# Altium schematic sheet Connectors.SchDoc: Arm - Connectors
size Letter; DrawnBy: K.Hong, N.Chapman; Organization: UW Robotics; Address1: 200 University Avenue; Address2: Waterloo; Address3: Ontario; Address4: Canada N2L 3G6; SheetNumber: 3; SheetTotal: 9
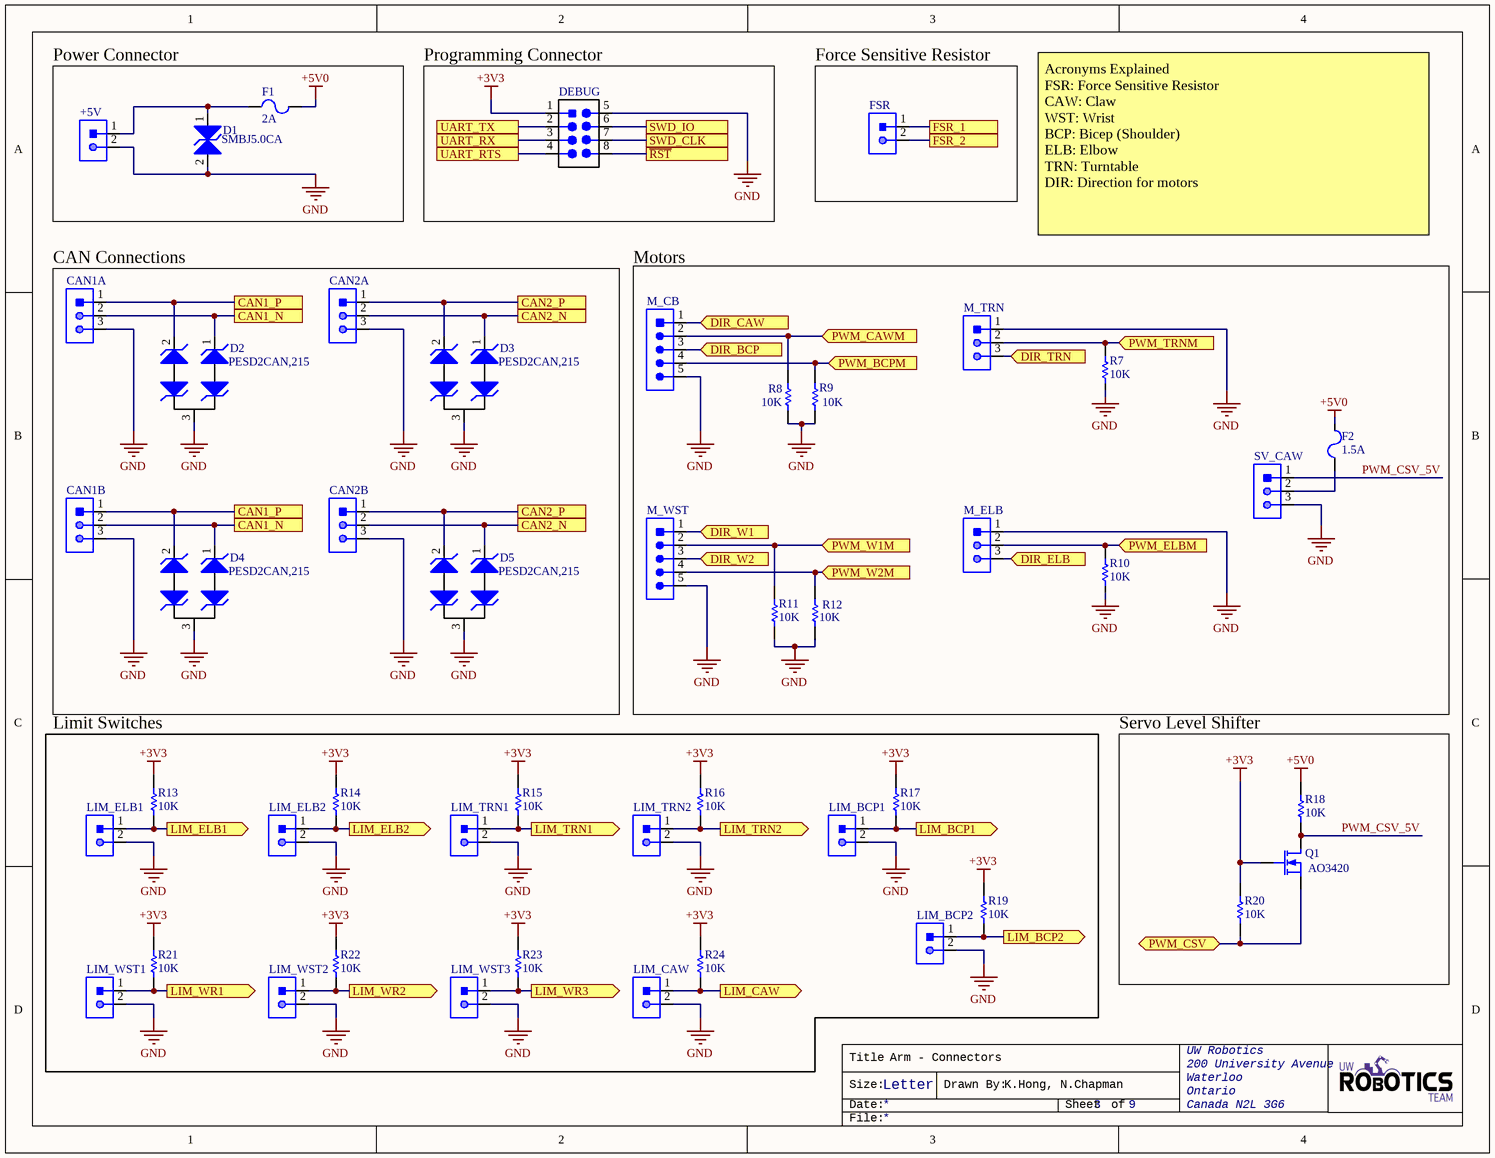
[diagram p0: Connectors.SchDoc]

## Parts
+5V  CON_2M_SM4  [JST-B2B-SM4-TB]  (value not drawn)
CAN1A  CON_3M_SM4  [JST-B3B-SM4-TB]  (value not drawn)
CAN1B  CON_3M_SM4  [JST-B3B-SM4-TB]  (value not drawn)
CAN2A  CON_3M_SM4  [JST-B3B-SM4-TB]  (value not drawn)
CAN2B  CON_3M_SM4  [JST-B3B-SM4-TB]  (value not drawn)
D1  Manufacturer Part Number 1: SMBJ5.0CA  [TVS_DIODE_BIDIRECTIONAL]  (hidden comment: TVS_DIODE_BIDIRECTIONAL)
D2  Manufacturer Part Number: PESD2CAN,215  [NXP-SOT323-3]  (hidden comment: TVS_DIODE_CAN)
D3  Manufacturer Part Number: PESD2CAN,215  [NXP-SOT323-3]  (hidden comment: TVS_DIODE_CAN)
D4  Manufacturer Part Number: PESD2CAN,215  [NXP-SOT323-3]  (hidden comment: TVS_DIODE_CAN)
D5  Manufacturer Part Number: PESD2CAN,215  [NXP-SOT323-3]  (hidden comment: TVS_DIODE_CAN)
DEBUG  HEADER 4X2  [HEADER_2X4]  (value not drawn)
F1  Current Rating: 2A  [FUSE_0603]  (hidden comment: FUSE_2A_0603)
F2  Current Rating: 1.5A  [FUSE_0603]  (hidden comment: FUSE_1.5A_0603)
FSR  CON_2M_SM4  [JST-B2B-SM4-TB]  (value not drawn)
LIM_BCP1  CON_2M_SM4  [JST-B2B-SM4-TB]  (value not drawn)
LIM_BCP2  CON_2M_SM4  [JST-B2B-SM4-TB]  (value not drawn)
LIM_CAW  CON_2M_SM4  [JST-B2B-SM4-TB]  (value not drawn)
LIM_ELB1  CON_2M_SM4  [JST-B2B-SM4-TB]  (value not drawn)
LIM_ELB2  CON_2M_SM4  [JST-B2B-SM4-TB]  (value not drawn)
LIM_TRN1  CON_2M_SM4  [JST-B2B-SM4-TB]  (value not drawn)
LIM_TRN2  CON_2M_SM4  [JST-B2B-SM4-TB]  (value not drawn)
LIM_WST1  CON_2M_SM4  [JST-B2B-SM4-TB]  (value not drawn)
LIM_WST2  CON_2M_SM4  [JST-B2B-SM4-TB]  (value not drawn)
LIM_WST3  CON_2M_SM4  [JST-B2B-SM4-TB]  (value not drawn)
M_CB  CON_5M_SM4  [JST-B5B-SM4-TB]  (value not drawn)
M_ELB  CON_3M_SM4  [JST-B3B-SM4-TB]  (value not drawn)
M_TRN  CON_3M_SM4  [JST-B3B-SM4-TB]  (value not drawn)
M_WST  CON_5M_SM4  [JST-B5B-SM4-TB]  (value not drawn)
Q1  MPN: AO3420  [NMOS_SOT23-3]  (hidden comment: NMOS_20V_6A)
R7  value 10K  [RESC0603(1608)_N]  (hidden comment: RES_10K_0603)
R8  value 10K  [RESC0603(1608)_N]  (hidden comment: RES_10K_0603)
R9  value 10K  [RESC0603(1608)_N]  (hidden comment: RES_10K_0603)
R10  value 10K  [RESC0603(1608)_N]  (hidden comment: RES_10K_0603)
R11  value 10K  [RESC0603(1608)_N]  (hidden comment: RES_10K_0603)
R12  value 10K  [RESC0603(1608)_N]  (hidden comment: RES_10K_0603)
R13  value 10K  [RESC0603(1608)_N]  (hidden comment: RES_10K_0603)
R14  value 10K  [RESC0603(1608)_N]  (hidden comment: RES_10K_0603)
R15  value 10K  [RESC0603(1608)_N]  (hidden comment: RES_10K_0603)
R16  value 10K  [RESC0603(1608)_N]  (hidden comment: RES_10K_0603)
R17  value 10K  [RESC0603(1608)_N]  (hidden comment: RES_10K_0603)
R18  value 10K  [RESC0603(1608)_N]  (hidden comment: RES_10K_0603)
R19  value 10K  [RESC0603(1608)_N]  (hidden comment: RES_10K_0603)
R20  value 10K  [RESC0603(1608)_N]  (hidden comment: RES_10K_0603)
R21  value 10K  [RESC0603(1608)_N]  (hidden comment: RES_10K_0603)
R22  value 10K  [RESC0603(1608)_N]  (hidden comment: RES_10K_0603)
R23  value 10K  [RESC0603(1608)_N]  (hidden comment: RES_10K_0603)
R24  value 10K  [RESC0603(1608)_N]  (hidden comment: RES_10K_0603)
SV_CAW  CON_3M_SM4  [JST-B3B-SM4-TB]  (value not drawn)

## Blocks framed on the sheet
Power Connector: +5V D1 F1
Programming Connector: DEBUG
Force Sensitive Resistor: FSR
CAN Connections: CAN1A CAN1B CAN2A CAN2B D2-D5
Motors: F2 M_CB M_ELB M_TRN M_WST R7-R12 SV_CAW
Limit Switches: LIM_BCP1 LIM_BCP2 LIM_CAW LIM_ELB1 LIM_ELB2 LIM_TRN1 LIM_TRN2 LIM_WST1-LIM_WST3 R13-R17 R19 R21-R24
Servo Level Shifter: Q1 R18 R20

## Ports
CAN1_N, CAN1_P, CAN2_N, CAN2_P, DIR_BCP (in), DIR_CAW (in), DIR_ELB (in), DIR_TRN (in), DIR_W1 (in), DIR_W2 (in), FSR_1, FSR_2, LIM_BCP1 (out), LIM_BCP2 (out), LIM_CAW (out), LIM_ELB1 (out), LIM_ELB2 (out), LIM_TRN1 (out), LIM_TRN2 (out), LIM_WR1 (out), LIM_WR2 (out), LIM_WR3 (out), PWM_BCPM (in), PWM_CAWM (in), PWM_CSV (bidir), PWM_ELBM (in), PWM_TRNM (in), PWM_W1M (in), PWM_W2M (in), SWD_CLK, SWD_IO, UART_RTS, UART_RX, UART_TX, ~{RST}

## Nets
+3V3: DEBUG.1(VCC) Q1.1(G) R13.2 R14.2 R15.2 R16.2 R17.2 R19.2 R20.2 R21.2 R22.2 R23.2 R24.2
+5V0: F1.2 F2.2 R18.2
GND: +5V.2 CAN1A.3 CAN1B.3 CAN2A.3 CAN2B.3 D1.2 D2.3 D3.3 D4.3 D5.3 DEBUG.5(GND) LIM_BCP1.2 LIM_BCP2.2 LIM_CAW.2 LIM_ELB1.2 LIM_ELB2.2 LIM_TRN1.2 LIM_TRN2.2 LIM_WST1.2 LIM_WST2.2 LIM_WST3.2 M_CB.5 M_ELB.1 M_TRN.1 M_WST.5 R7.1 R8.1 R9.1 R10.1 R11.1 R12.1 SV_CAW.3
~{RST}: DEBUG.8 ; port ~{RST}
CAN1_N: CAN1A.2 CAN1B.2 D2.1 D4.1 ; port CAN1_N
CAN1_P: CAN1A.1 CAN1B.1 D2.2 D4.2 ; port CAN1_P
CAN2_N: CAN2A.2 CAN2B.2 D3.1 D5.1 ; port CAN2_N
CAN2_P: CAN2A.1 CAN2B.1 D3.2 D5.2 ; port CAN2_P
DIR_BCP: M_CB.3 ; port DIR_BCP
DIR_CAW: M_CB.1 ; port DIR_CAW
DIR_ELB: M_ELB.3 ; port DIR_ELB
DIR_TRN: M_TRN.3 ; port DIR_TRN
DIR_W1: M_WST.1 ; port DIR_W1
DIR_W2: M_WST.3 ; port DIR_W2
FSR_1: FSR.1 ; port FSR_1
FSR_2: FSR.2 ; port FSR_2
LIM_BCP1: LIM_BCP1.1 R17.1 ; port LIM_BCP1
LIM_BCP2: LIM_BCP2.1 R19.1 ; port LIM_BCP2
LIM_CAW: LIM_CAW.1 R24.1 ; port LIM_CAW
LIM_ELB1: LIM_ELB1.1 R13.1 ; port LIM_ELB1
LIM_ELB2: LIM_ELB2.1 R14.1 ; port LIM_ELB2
LIM_TRN1: LIM_TRN1.1 R15.1 ; port LIM_TRN1
LIM_TRN2: LIM_TRN2.1 R16.1 ; port LIM_TRN2
LIM_WR1: LIM_WST1.1 R21.1 ; port LIM_WR1
LIM_WR2: LIM_WST2.1 R22.1 ; port LIM_WR2
LIM_WR3: LIM_WST3.1 R23.1 ; port LIM_WR3
PWM_BCPM: M_CB.4 R9.2 ; port PWM_BCPM
PWM_CAWM: M_CB.2 R8.2 ; port PWM_CAWM
PWM_CSV: Q1.2(S) R20.1 ; port PWM_CSV
PWM_CSV_5V: Q1.3(D) R18.1 SV_CAW.1
PWM_ELBM: M_ELB.2 R10.2 ; port PWM_ELBM
PWM_TRNM: M_TRN.2 R7.2 ; port PWM_TRNM
PWM_W1M: M_WST.2 R11.2 ; port PWM_W1M
PWM_W2M: M_WST.4 R12.2 ; port PWM_W2M
SWD_CLK: DEBUG.7 ; port SWD_CLK
SWD_IO: DEBUG.6 ; port SWD_IO
UART_RTS: DEBUG.4 ; port UART_RTS
UART_RX: DEBUG.3 ; port UART_RX
UART_TX: DEBUG.2 ; port UART_TX
Net+5V_1: +5V.1 D1.1 F1.1
NetF2_1: F2.1 SV_CAW.2

## Notes on the sheet
- Acronyms Explained
  FSR: Force Sensitive Resistor
  CAW: Claw
  WST: Wrist
  BCP: Bicep (Shoulder)
  ELB: Elbow
  TRN: Turntable
  DIR: Direction for motors
- Title
- Size:
- Date:
- Letter
- Drawn By:
- Sheet
- of
- File:

## Library data of the parts
+5V FSR LIM_BCP1 LIM_BCP2 LIM_CAW LIM_ELB1 LIM_ELB2 LIM_TRN1 LIM_TRN2 LIM_WST1-LIM_WST3 = CON_2M_SM4: CONN HEADER SMD 2POS 2MM; Manufacturer: JST; Manufacturer Part Number: B2B-PH-SM4-TB(LF)(SN); Max Current Rating: 2A; Max Voltage Rating: 100V; Supplier 1: Digi-Key; Supplier Part Number 1: 455-1734-1-ND; ComponentLink1URL: https://datasheet.ciiva.com/11748/0900766b80ddea81-11748001.pdf?src-supplier=RSComponents; ComponentLink1Description: https://datasheet.ciiva.com/11748/0900766b80ddea81-11748001.pdf?src-supplier=RSComponents; ComponentLink2URL: https://datasheet.ciiva.com/16216/b2b-ph-sm4-tblfsn-16216102.pdf?src-supplier=Future+Electronics; ComponentLink2Description: https://datasheet.ciiva.com/16216/b2b-ph-sm4-tblfsn-16216102.pdf?src-supplier=Future+Electronics; ComponentLink3URL: https://datasheet.ciiva.com/8052/80567-8052023.pdf?src-supplier=Element14; ComponentLink3Description: https://datasheet.ciiva.com/8052/80567-8052023.pdf?src-supplier=Element14; ComponentLink4URL: https://datasheet.ciiva.com/712/eph-712504.pdf?src-supplier=Digi-Key; ComponentLink4Description: https://datasheet.ciiva.com/712/eph-712504.pdf?src-supplier=Digi-Key; ComponentLink5URL: https://datasheet.ciiva.com/712/eph-712505.pdf?src-supplier=Digi-Key; ComponentLink5Description: https://datasheet.ciiva.com/712/eph-712505.pdf?src-supplier=Digi-Key; ComponentLink6URL: https://datasheet.ciiva.com/712/eph-712506.pdf?src-supplier=Digi-Key; ComponentLink6Description: https://datasheet.ciiva.com/712/eph-712506.pdf?src-supplier=Digi-Key; Pitch: 2mm
CAN1A CAN1B CAN2A CAN2B M_ELB M_TRN SV_CAW = CON_3M_SM4: CONN HEADER SMD 3POS 2MM; Manufacturer: JST; Manufacturer Part Number: B3B-PH-SM4-TB(LF)(SN); Max Current Rating: 2A; Max Voltage Rating: 100V; Supplier 1: Digi-Key; Supplier Part Number 1: 455-1735-1-ND; ComponentLink1URL: https://datasheet.ciiva.com/11747/0900766b80ddea81-11747684.pdf?src-supplier=RSComponents; ComponentLink1Description: https://datasheet.ciiva.com/11747/0900766b80ddea81-11747684.pdf?src-supplier=RSComponents; Pitch: 2mm
D1 = TVS_DIODE_BIDIRECTIONAL: TVS DIODE 5V 9.2V DO214AA; Manufacturer 1: Littelfuse; Max Surge Current: 65.3A; Reverse Breakdown Voltage: 6.4V; Peak Pulse Power: 600W; Max Breakdown Voltage: 7V; ESD Protection: Yes; Package: DO-214AA, SMB; ComponentLink1Description: Datasheet; ComponentLink1URL: https://www.littelfuse.com/~/media/electronics/datasheets/tvs_diodes/littelfuse_tvs_diode_smbj_datasheet.pdf.pdf; Supplier Part Number 1: SMBJ5.0CALFCT-ND; Supplier 1: Digi-Key; Mount: Surface Mount; Min Operating Temperature: -65°C; Max Operating Temperature: 150°C; Direction: Bidirectional; Reverse Standoff Voltage: 5V; Min Breakdown Voltage: 6.4V; Clamping Voltage: 9.2V; Breakdown Voltage: 6.4V; Polarity: Bidirectional; Power Dissipation: 600W; Peak Pulse Current: 65.3A; Composition: Zener
D2-D5 = TVS_DIODE_CAN: TVS DIODE 24V 41V SOT323-3; Manufacturer: Nexperia USA Inc.; Package: SC-70, SOT-323; ComponentLink1Description: Datasheet; ComponentLink1URL: https://assets.nexperia.com/documents/data-sheet/PESD1CAN-U.pdf; Supplier Part Number 1: 1727-3891-1-ND; Supplier 1: Digi-Key
DEBUG = HEADER 4X2: CONN HEADER VERT 8POS 2.54MM; Manufacturer Part Number 1: M20-9980445; Manufacturer 1: Harwin Inc.; Supplier Part Number 1: 952-2122-ND; Supplier 1: Digi-Key
F1 = FUSE_2A_0603: FUSE SMD 2A 32V; ComponentLink1URL: https://datasheet.ciiva.com/303/467-303400.pdf?src-supplier=Digi-Key; ComponentLink1Description: https://datasheet.ciiva.com/303/467-303400.pdf?src-supplier=Digi-Key; ComponentLink2URL: http://datasheet.octopart.com/0467002.NRHF-Littelfuse-datasheet-32023482.pdf?src-supplier=Future+Electronics; ComponentLink2Description: http://datasheet.octopart.com/0467002.NRHF-Littelfuse-datasheet-32023482.pdf?src-supplier=Future+Electronics; ComponentLink3URL: http://datasheet.octopart.com/0467002.NRHF-Littelfuse-datasheet-136509808.pdf?src-supplier=Future+Electronics; ComponentLink3Description: http://datasheet.octopart.com/0467002.NRHF-Littelfuse-datasheet-136509808.pdf?src-supplier=Future+Electronics; Mount: Surface Mount; Voltage Rating (AC): 32V; Voltage Rating (DC): 32V; Supplier 1: Digi-Key; Supplier Part Number 1: F7132CT-ND; Supplier Packaging 1: Cut Tape
F2 = FUSE_1.5A_0603: FUSE SMD 1.5A 32V; ComponentLink1URL: https://datasheet.ciiva.com/26890/getdatasheetpartid-721713-26890390.pdf?src-supplier=Verical; ComponentLink1Description: https://datasheet.ciiva.com/26890/getdatasheetpartid-721713-26890390.pdf?src-supplier=Verical; ComponentLink2URL: https://datasheet.ciiva.com/7464/467-7464069.pdf?src-supplier=Digi-Key; ComponentLink2Description: https://datasheet.ciiva.com/7464/467-7464069.pdf?src-supplier=Digi-Key; ComponentLink3URL: https://datasheet.ciiva.com/7464/467-7464072.pdf?src-supplier=Digi-Key; ComponentLink3Description: https://datasheet.ciiva.com/7464/467-7464072.pdf?src-supplier=Digi-Key; Mount: Surface Mount; Voltage Rating (AC): 32V; Voltage Rating (DC): 32V; Supplier 1: Digi-Key; Supplier Part Number 1: F5702CT-ND; Supplier Packaging 1: Cut Tape
M_CB M_WST = CON_5M_SM4: CONN HEADER SMD 5POS 2MM; Manufacturer: JST; Manufacturer Part Number: B5B-PH-SM4-TB(LF)(SN); Max Current Rating: 2A; Max Voltage Rating: 100V; Supplier 1: Digi-Key; ComponentLink1URL: https://datasheet.ciiva.com/11749/0900766b80ddea81-11749188.pdf?src-supplier=RSComponents; ComponentLink1Description: https://datasheet.ciiva.com/11749/0900766b80ddea81-11749188.pdf?src-supplier=RSComponents; ComponentLink2URL: https://datasheet.ciiva.com/712/eph-712595.pdf?src-supplier=Digi-Key; ComponentLink2Description: https://datasheet.ciiva.com/712/eph-712595.pdf?src-supplier=Digi-Key; ComponentLink3URL: https://datasheet.ciiva.com/712/eph-712596.pdf?src-supplier=Digi-Key; ComponentLink3Description: https://datasheet.ciiva.com/712/eph-712596.pdf?src-supplier=Digi-Key; ComponentLink4URL: https://datasheet.ciiva.com/730/eph-730612.pdf?src-supplier=Digi-Key; ComponentLink4Description: https://datasheet.ciiva.com/730/eph-730612.pdf?src-supplier=Digi-Key; ComponentLink5URL: https://datasheet.ciiva.com/16344/eph-16344920.pdf?src-supplier=Future+Electronics; ComponentLink5Description: https://datasheet.ciiva.com/16344/eph-16344920.pdf?src-supplier=Future+Electronics; Supplier Part Number 1: 455-1737-1-ND; Pitch: 2mm
Q1 = NMOS_20V_6A: MOSFET N-CH 20V 6A SOT23; Manufacturer: Alpha & Omega; Package: TO-236-3, SC-59, SOT-23-3; ComponentLink1Description: Datasheet; ComponentLink1URL: http://aosmd.com/res/data_sheets/AO3420.pdf; Supplier Part Number 1: 785-1014-1-ND; Supplier 1: Digi-Key
R7-R24 = RES_10K_0603: RES SMD 10K OHM 5% 1/10W 0603; Manufacturer: Yageo; MPN: RC0603JR-0710KL; Package: 0603 (1608 Metric); Dimensions: 0.063" L x 0.031" W (1.60mm x 0.80mm); Tolerance: 5%; Supplier Part Number 1: 311-10KGRCT-ND; Supplier 1: Digi-Key